# Altium project B293B MiRLIN Integrated PIC32.PrjPcb (part 1 of 2)
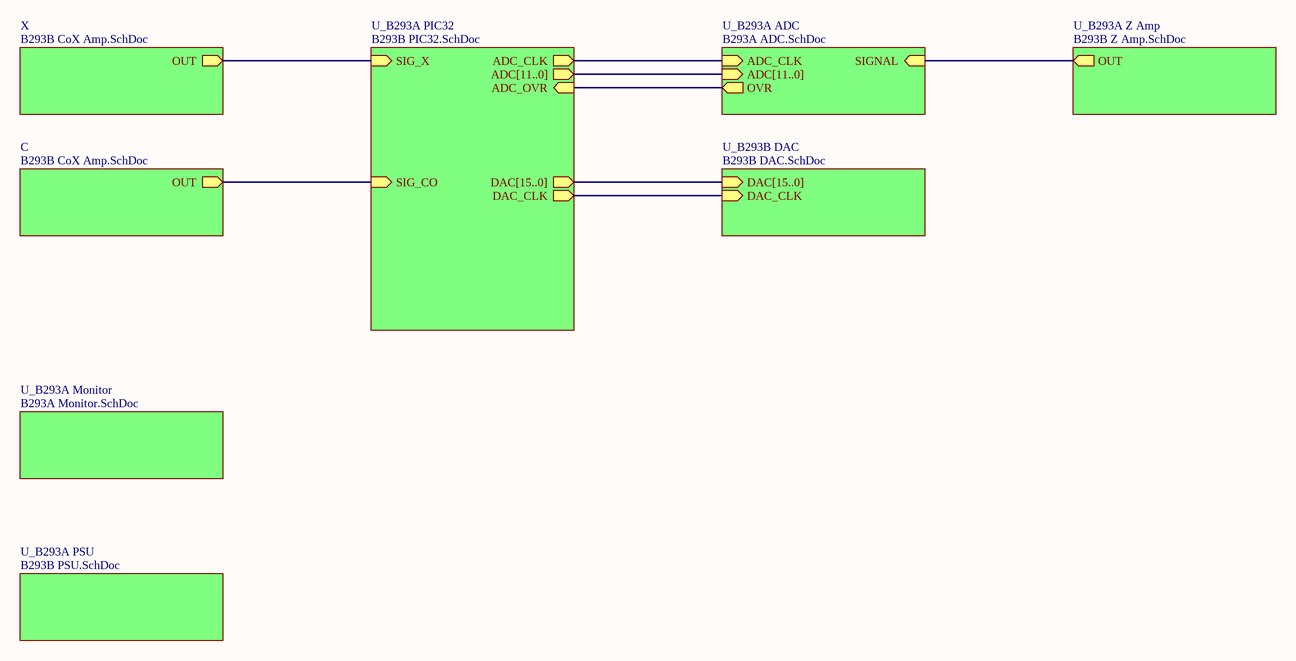
[diagram p0: B293B Top.SchDoc]
8 sheets, 227 parts. Net scope: hierarchical (ports join the sheet entries above them; power ports are global).
Board file: B293B MiRLIN Integrated PIC32.PcbDoc
Sheets:
  B293B Top.SchDoc
    U_B293A ADC = B293A ADC.SchDoc
    U_B293B DAC = B293B DAC.SchDoc
    U_B293A Monitor = B293A Monitor.SchDoc
    U_B293A PIC32 = B293B PIC32.SchDoc
    U_B293A PSU = B293B PSU.SchDoc
    U_B293A Z Amp = B293B Z Amp.SchDoc
    X = B293B CoX Amp.SchDoc
    C = B293B CoX Amp.SchDoc

## Sheet B293B Top.SchDoc
size A4

### Sub-sheets
C = B293B CoX Amp.SchDoc: OUT (out)
U_B293A ADC = B293A ADC.SchDoc: ADC_CLK (in), ADC[11..0] (in), OVR (out), SIGNAL (in)
U_B293A Monitor = B293A Monitor.SchDoc: no entries
U_B293A PIC32 = B293B PIC32.SchDoc: ADC_CLK (out), ADC[11..0] (out), ADC_OVR (in), DAC[15..0] (out), DAC_CLK (out), SIG_X (in), SIG_CO (in)
U_B293A PSU = B293B PSU.SchDoc: no entries
U_B293A Z Amp = B293B Z Amp.SchDoc: OUT (out)
U_B293B DAC = B293B DAC.SchDoc: DAC[15..0] (in), DAC_CLK (in)
X = B293B CoX Amp.SchDoc: OUT (out)

### Nets
ADC_CLK: sheet U_B293A ADC/ADC_CLK, sheet U_B293A PIC32/ADC_CLK
CLK: sheet U_B293B DAC/DAC_CLK, sheet U_B293A PIC32/DAC_CLK
OVR: sheet U_B293A ADC/OVR, sheet U_B293A PIC32/ADC_OVR
NetR2_2: sheet U_B293A ADC/SIGNAL, sheet U_B293A Z Amp/OUT
NetR16_C_2: sheet U_B293A PIC32/SIG_CO, sheet C/OUT
NetR16_X_2: sheet U_B293A PIC32/SIG_X, sheet X/OUT

### Buses and harness runs
bus sheet U_B293A ADC/ADC[11..0] = sheet U_B293A PIC32/ADC[11..0]
bus sheet U_B293A PIC32/DAC[15..0] = sheet U_B293B DAC/DAC[15..0]

## Sheet B293A ADC.SchDoc: ADC
size A4; DocumentNumber: 293; Revision: A
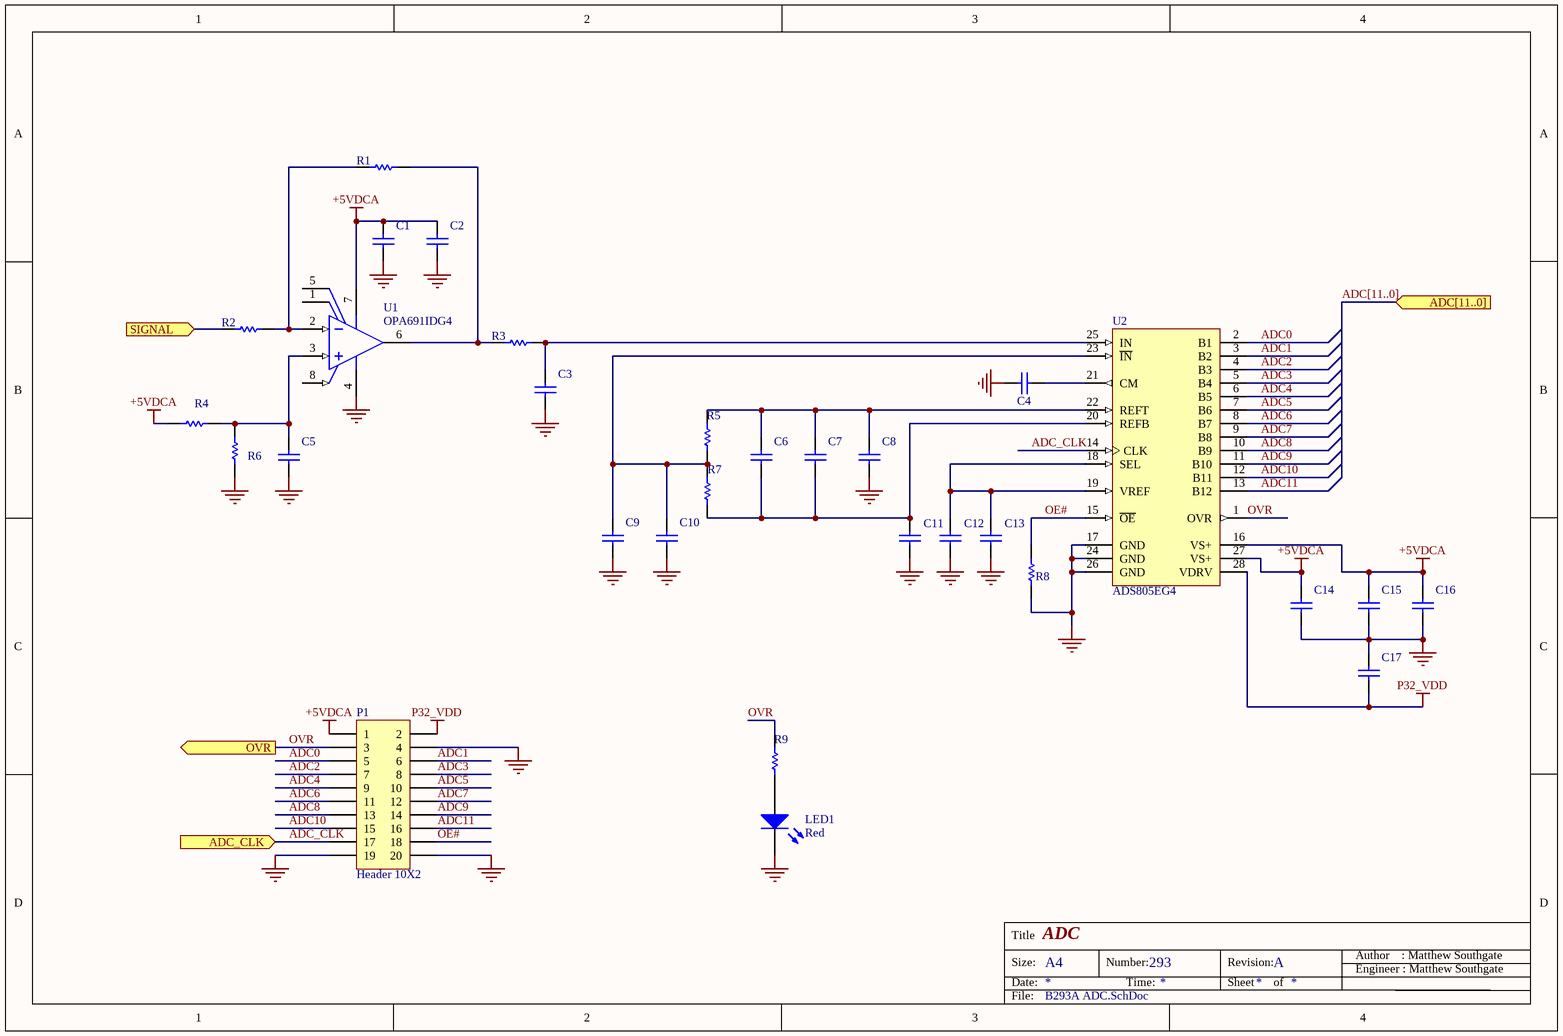
[diagram p1: B293A ADC.SchDoc]

### Parts
C1  CAP 100nF 50V 0805(2012)  [CAPC0805(2012)75_L]  (value not drawn)
C2  CAP 10uF 25V 0805(2012)  [CAPC0805(2012)145_N]  (value not drawn)
C3  CAP 1.5nF 50V 0805(2012)  [CAPC0805(2012)75_M]  (value not drawn)
C4  CAP 100nF 50V 0805(2012)  [CAPC0805(2012)75_L]  (value not drawn)
C5  CAP 100nF 50V 0805(2012)  [CAPC0805(2012)75_L]  (value not drawn)
C6  CAP 10uF 25V 0805(2012)  [CAPC0805(2012)145_N]  (value not drawn)
C7  CAP 100nF 50V 0805(2012)  [CAPC0805(2012)75_L]  (value not drawn)
C8  CAP 100nF 50V 0805(2012)  [CAPC0805(2012)75_L]  (value not drawn)
C9  CAP 10uF 25V 0805(2012)  [CAPC0805(2012)145_N]  (value not drawn)
C10  CAP 100nF 50V 0805(2012)  [CAPC0805(2012)75_L]  (value not drawn)
C11  CAP 100nF 50V 0805(2012)  [CAPC0805(2012)75_L]  (value not drawn)
C12  CAP 10uF 25V 0805(2012)  [CAPC0805(2012)145_N]  (value not drawn)
C13  CAP 100nF 50V 0805(2012)  [CAPC0805(2012)75_L]  (value not drawn)
C14  CAP 100nF 50V 0805(2012)  [CAPC0805(2012)75_L]  (value not drawn)
C15  CAP 100nF 50V 0805(2012)  [CAPC0805(2012)75_L]  (value not drawn)
C16  CAP 2.2uF 50V 0805(2012)  [CAPC0805(2012)145_M]  (value not drawn)
C17  CAP 100nF 50V 0805(2012)  [CAPC0805(2012)75_L]  (value not drawn)
LED1  Red  [1206 - LED]
P1  Header 10X2  [HDR2X10]
R1  1K8 5% 0805(2012)  [RESC0805(2012)_N]  (value not drawn)
R2  1K8 5% 0805(2012)  [RESC0805(2012)_N]  (value not drawn)
R3  47R 5% 0805(2012)  [RESC0805(2012)_M]  (value not drawn)
R4  1K8 5% 0805(2012)  [RESC0805(2012)_N]  (value not drawn)
R5  1K8 5% 0805(2012)  [RESC0805(2012)_N]  (value not drawn)
R6  680R 1% 0805(2012)  [RESC0805(2012)_L]  (value not drawn)
R7  1K8 5% 0805(2012)  [RESC0805(2012)_N]  (value not drawn)
R8  10K 1% 0805(2012)  [RESC0805(2012)_M]  (value not drawn)
R9  1K 5% 0805(2012)  [RESC0805(2012)_N]  (value not drawn)
U1  OPA691IDG4  [TI-D8_N]
U2  ADS805EG4  [TI-DB28_M]

### Ports
ADC[11..0] (in), ADC_CLK (in), OVR (out), SIGNAL (in)

### Nets
+5VDCA: C1.2 C2.2 C14.2 C15.2 C16.2 P1.1 R4.1 U1.7(VS+) U2.16(VS+) U2.27(VS+)  [project net V_+5VDCA]
GND: C1.1 C2.1 C3.1 C4.1 C5.1 C8.1 C9.1 C10.1 C11.1 C12.1 C13.1 C14.1 C15.1 C16.1 C17.2 LED1.K P1.4 P1.19 P1.20 R6.2 R8.2 U1.4(VS-) U2.17(GND) U2.24(GND) U2.26(GND)  [project net VSS]
P32_VDD: C17.1 P1.2 U2.28(VDRV)  [project net MON_VDD]
ADC0: P1.5 U2.2(B1)
ADC1: P1.6 U2.3(B2)
ADC2: P1.7 U2.4(B3)
ADC3: P1.8 U2.5(B4)
ADC4: P1.9 U2.6(B5)
ADC5: P1.10 U2.7(B6)
ADC6: P1.11 U2.8(B7)
ADC7: P1.12 U2.9(B8)
ADC8: P1.13 U2.10(B9)
ADC9: P1.14 U2.11(B10)
ADC10: P1.15 U2.12(B11)
ADC11: P1.16 U2.13(B12)
ADC_CLK: P1.17 U2.14(CLK) ; port ADC_CLK
OE#: P1.18 R8.1 U2.15(~{OE})
OVR: P1.3 R9.2 U2.1(OVR) ; port OVR
NetC3_2: C3.2 R3.1 U2.25(IN)
NetC4_2: C4.2 U2.21(CM)
NetC5_2: C5.2 R4.2 R6.1 U1.3(IN+)
NetC6_1: C6.1 C7.1 C11.2 R7.1 U2.20(REFB)
NetC6_2: C6.2 C7.2 C8.2 R5.2 U2.22(REFT)
NetC9_2: C9.2 C10.2 R5.1 R7.2 U2.23(~{IN})
NetC12_2: C12.2 C13.2 U2.18(SEL) U2.19(VREF)
NetLED1_A: LED1.A R9.1
NetR1_1: R1.1 R3.2 U1.6(OUT)
NetR1_2: R1.2 R2.1 U1.2(IN-)
NetR2_2: R2.2 ; port SIGNAL

Not connected (* = marked no-connect by the designer): U1 1(NC) 5(NC) 8(~{DIS})

### Buses and harness runs
bus ADC[11..0] = port ADC[11..0]

### Notes on the sheet
- Title
- Size:
- Date:
- A4
- Number:
- Time:
- Revision:
- Sheet
- of
- Engineer : Matthew Southgate
- Author    : Matthew Southgate
- File:

### Library data of the parts
C1 C4 C5 C7 C8 C10 C11 C13-C15 C17 = CMP-1036-04421-1: CAP 100nF 50V ±20% 0805 (2012 Metric) Thickness 0.75mm SMD; Case-Metric: 2012; Case-EIA: 0805; Value: 100nF; Max Thickness: 0.75 mm; Rated Voltage: 50 V; Tolerance: ±20%; Technology: SMT
C2 C6 C9 C12 = CMP-1036-04933-1: CAP 10uF 25V ±20% 0805 (2012 Metric) Thickness 1.45mm SMD; Case-EIA: 0805; Case-Metric: 2012; Technology: SMT; Tolerance: ±20%; Max Thickness: 1.45 mm; Value: 10uF; Rated Voltage: 25 V
C3 = CMP-1036-03122-1: CAP 1.5nF 50V ±10% 0805 (2012 Metric) Thickness 0.75mm SMD; Case-Metric: 2012; Case-EIA: 0805; Rated Voltage: 50 V; Technology: SMT; Value: 1.5nF; Max Thickness: 0.75 mm; Tolerance: ±10%
C16 = CMP-1036-04844-1: CAP 2.2uF 50V ±10% 0805 (2012 Metric) Thickness 1.45mm SMD; Case-Metric: 2012; Case-EIA: 0805; Tolerance: ±10%; Technology: SMT; Value: 2.2uF; Rated Voltage: 50 V; Max Thickness: 1.45 mm
LED1 = LED 1206 RED: LED, ALINGAP, SMD, 1206, RED; Manufacturer Part Number: KPC-3216SURCK; Manufacturer: KINGBRIGHT; Order Code: 1318261; Supplier: Farnell; Supplier 1: Farnell; RoHS: YES; Stock 1: 179; Pricing 1: 10=0.117, 50=0.097, 100=0.083, 250=0.074, 500=0.067, 800=0.0603, 800=0.0543, 7000=0.0488 (GBP); ComponentLink1URL: http://www.us.kingbright.com/images/catalog/SPEC/APC3216SURCK.pdf; ComponentLink1Description: http://www.us.kingbright.com/images/catalog/SPEC/APC3216SURCK.pdf; Supplier Part Number 1: 1318261
P1 = Header 10X2: Header, 10-Pin, Dual row; Fitted: No; LatestRevisionDate: 17-Jul-2002; LatestRevisionNote: Re-released for DXP Platform.; Publisher: Altium Limited
R1 R2 R4 R5 R7 = CMP-1013-00080-1: 1K8 0.125W 5% 0805 (2012 Metric)  SMD; Case-Metric: 2012; Value: 1800.00 Ohm; Case-EIA: 0805; Tolerance: 5 %; Technology: SMT; Power: 0.125 W
R3 = CMP-1013-00042-1: 47R 0.125W 5% 0805 (2012 Metric)  SMD; Value: 47.00 Ohm; Case-Metric: 2012; Case-EIA: 0805; Technology: SMT; Tolerance: 5 %; Power: 0.125 W
R6 = CMP-1013-00491-1: 680R 0.125W 1% 0805 (2012 Metric)  SMD; Case-EIA: 0805; Value: 680.00 Ohm; Case-Metric: 2012; Technology: SMT; Tolerance: 1 %; Power: 0.125 W
R8 = CMP-1013-00623-1: 10K 0.125W 1% 0805 (2012 Metric)  SMD; Case-Metric: 2012; Value: 10000.00 Ohm; Case-EIA: 0805; Power: 0.125 W; Technology: SMT; Tolerance: 1 %
R9 = CMP-1013-00074-1: 1K 0.125W 5% 0805 (2012 Metric)  SMD; Case-Metric: 2012; Case-EIA: 0805; Value: 1000.00 Ohm; Tolerance: 5 %; Technology: SMT; Power: 0.125 W
U1 = CMP-0018-00355-1: Wideband Current Feedback Operational Amplifier with Disable, 5 to 12 V, -40 to 85 degC, 8-pin SOIC (D8), Green (RoHS & no Sb/Br); Manufacturer: Texas Instruments; ComponentLink3Description: Package Specification; PackageVersion: 4040047-3/M, 06/2011; ComponentLink2Description: Datasheet; PackageReference: D8; DatasheetVersion: SBOS226D; ComponentLink1Description: Manufacturer URL; ComponentLink2URL: http://www.ti.com/general/docs/lit/getliterature.tsp?genericPartNumber=OPA691&fileType=pdf; ComponentLink3URL: http://www.ti.com/litv/pdf/msoi002j; PackageDescription: 8-Pin Plastic Small Outline, Body 4.9 x 3.9 mm, Pitch 1.27 mm; Code_JEDEC: MS-012; ComponentLink1URL: http://www.ti.com/
U2 = CMP-0003-00136-1: 12-Bit, 20 MSPS ADC Internal / External Reference, Flexible Input between 2 and 5 Vpp, Out of Range Indicator, -40 to 85 degC, 28-pin SOP (DB28), Green (RoHS & no Sb/Br); Manufacturer: Texas Instruments; PackageVersion: 4040065/E, 12/2001; ComponentLink2URL: http://www.ti.com/general/docs/lit/getliterature.tsp?genericPartNumber=ADS805&fileType=pdf; ComponentLink1URL: http://www.ti.com/; Code_JEDEC: MO-150; DatasheetVersion: SBAS073B; ComponentLink3URL: http://www.ti.com/lit/ml/msso002e/msso002e.pdf; ComponentLink1Description: Manufacturer URL; ComponentLink2Description: Datasheet; PackageDescription: 28-Pin Plastic Small Outline, Body 10.2 X 5.3 mm, Pitch 0.65 mm; PackageReference: DB28; ComponentLink3Description: Package Specification

## Sheet B293B DAC.SchDoc: DAC
size A4; DocumentNumber: 293; Revision: A
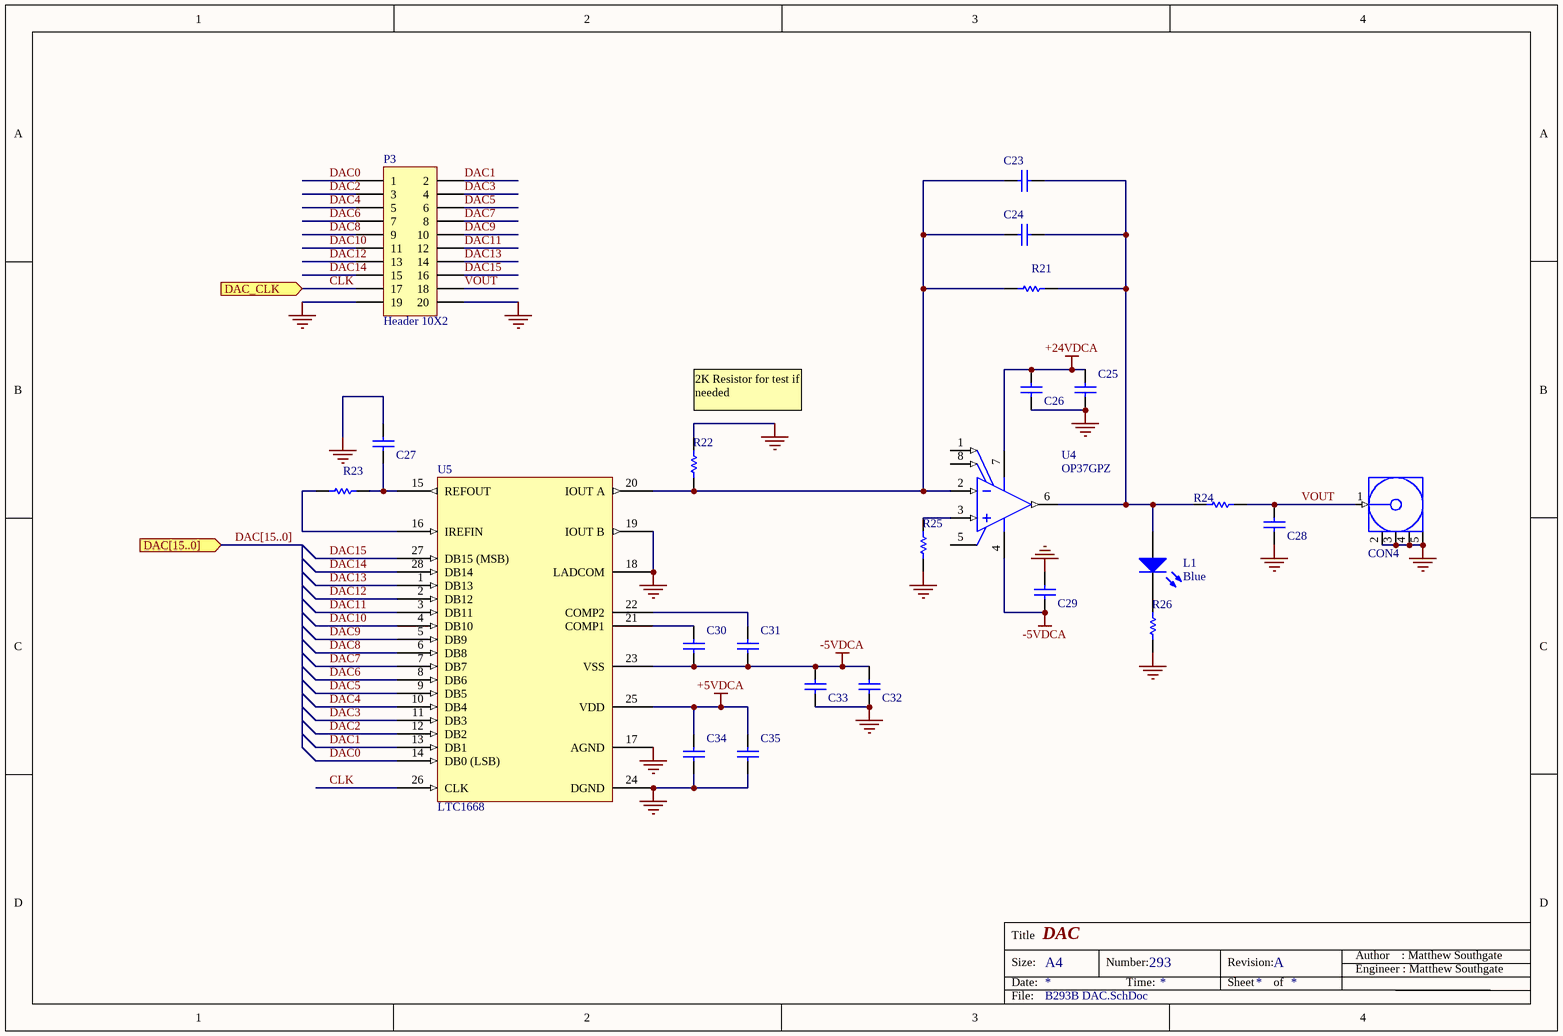
[diagram p2: B293B DAC.SchDoc]

### Parts
C23  CAP 4.7nF 50V 0805(2012)  [CAPC0805(2012)75_M]  (value not drawn)
C24  CAP 470pF 50V 0805(2012)  [CAPC0805(2012)100_M]  (value not drawn)
C25  CAP 10uF 25V 0805(2012)  [CAPC0805(2012)145_N]  (value not drawn)
C26  CAP 100nF 50V 0805(2012)  [CAPC0805(2012)100_M]  (value not drawn)
C27  CAP 100nF 50V 0805(2012)  [CAPC0805(2012)100_M]  (value not drawn)
C28  CAP 100nF 50V 0805(2012)  [CAPC0805(2012)100_M]  (value not drawn)
C29  CAP 100nF 50V 0805(2012)  [CAPC0805(2012)100_M]  (value not drawn)
C30  CAP 100nF 50V 0805(2012)  [CAPC0805(2012)100_M]  (value not drawn)
C31  CAP 100nF 50V 0805(2012)  [CAPC0805(2012)100_M]  (value not drawn)
C32  CAP 10uF 25V 0805(2012)  [CAPC0805(2012)145_N]  (value not drawn)
C33  CAP 100nF 50V 0805(2012)  [CAPC0805(2012)100_M]  (value not drawn)
C34  CAP 100nF 50V 0805(2012)  [CAPC0805(2012)100_M]  (value not drawn)
C35  CAP 10uF 25V 0805(2012)  [CAPC0805(2012)145_N]  (value not drawn)
CON4  SMA Vertical  [SMA Vertical]  (value not drawn)
L1  Blue  [1206 - LED]
P3  Header 10X2  [HDR2X10]
R21  2K2 5% 0805(2012)  [RESC0805(2012)_L]  (value not drawn)
R22  2K2 5% 0805(2012)  [RESC0805(2012)_L]  (value not drawn)
R23  2K2 5% 0805(2012)  [RESC0805(2012)_L]  (value not drawn)
R24  150R 5% 0805(2012)  [RESC0805(2012)_N]  (value not drawn)
R25  2K2 5% 0805(2012)  [RESC0805(2012)_L]  (value not drawn)
R26  6K8 5% 0805(2012)  [RESC0805(2012)_L]  (value not drawn)
U4  OP37GPZ  [ADI-N-8]
U5  LTC1668  [SOP65P800X200-28N]

### Ports
DAC[15..0] (in), DAC_CLK (in)

### Nets
+5VDCA: C34.2 C35.2 U5.25(VDD)  [project net V_+5VDCA]
+24VDCA: C25.2 C26.1 U4.7(V+)  [project net V_+24VDCA]
-5VDCA: C29.2 C30.1 C31.1 C32.1 C33.2 U4.4(V-) U5.23(VSS)  [project net V_-5VDCA]
GND: C25.1 C26.2 C27.1 C28.2 C29.1 C32.2 C33.1 C34.1 C35.1 CON4.2(GND) CON4.3(GND) CON4.4(GND) CON4.5(GND) P3.19 P3.20 R22.2 R25.1 R26.1 U5.17(AGND) U5.18(LADCOM) U5.19(IOUT_B) U5.24(DGND)  [project net VSS]
CLK: P3.17 U5.26(CLK) ; port DAC_CLK
DAC0: P3.1 U5.14(DB0_(LSB))
DAC1: P3.2 U5.13(DB1)
DAC2: P3.3 U5.12(DB2)
DAC3: P3.4 U5.11(DB3)
DAC4: P3.5 U5.10(DB4)
DAC5: P3.6 U5.9(DB5)
DAC6: P3.7 U5.8(DB6)
DAC7: P3.8 U5.7(DB7)
DAC8: P3.9 U5.6(DB8)
DAC9: P3.10 U5.5(DB9)
DAC10: P3.11 U5.4(DB10)
DAC11: P3.12 U5.3(DB11)
DAC12: P3.13 U5.2(DB12)
DAC13: P3.14 U5.1(DB13)
DAC14: P3.15 U5.28(DB14)
DAC15: P3.16 U5.27(DB15_(MSB))
VOUT: C28.1 CON4.1(Signal) P3.18 R24.1
NetC23_1: C23.1 C24.1 L1.A R21.2 R24.2 U4.6(OUT)
NetC23_2: C23.2 C24.2 R21.1 R22.1 U4.2(-IN) U5.20(IOUT_A)
NetC27_2: C27.2 R23.2 U5.15(REFOUT)
NetC30_2: C30.2 U5.21(COMP1)
NetC31_2: C31.2 U5.22(COMP2)
NetL1_K: L1.K R26.2
NetR23_1: R23.1 U5.16(IREFIN)
NetR25_2: R25.2 U4.3(+IN)

Not connected (* = marked no-connect by the designer): U4 1(VOS_TRIM) 5(NC) 8(VOS_TRIM)

### Buses and harness runs
bus DAC[15..0] = port DAC[15..0]

### Notes on the sheet
- (near R22) 2K Resistor for test if needed
- Title
- Size:
- Date:
- A4
- Number:
- Time:
- Revision:
- Sheet
- of
- Engineer : Matthew Southgate
- Author    : Matthew Southgate
- File:

### Library data of the parts
C23 = CMP-1036-03591-1: CAP 4.7nF 50V ±10% 0805 (2012 Metric) Thickness 0.75mm SMD; Case-Metric: 2012; Case-EIA: 0805; Fitted: No; Technology: SMT; Rated Voltage: 50 V; Value: 4.7nF; Tolerance: ±10%; Max Thickness: 0.75 mm
C24 = CMP-1036-02672-1: CAP 470pF 50V ±10% 0805 (2012 Metric) Thickness 1mm SMD; Case-Metric: 2012; Case-EIA: 0805; Fitted: No; Rated Voltage: 50 V; Max Thickness: 1 mm; Tolerance: ±10%; Technology: SMT; Value: 470pF
C25 C32 C35 = CMP-1036-04933-1: as C2 on sheet B293A ADC; Technology: SMT; Tolerance: ±20%; Max Thickness: 1.45 mm; Value: 10uF; Rated Voltage: 25 V
C26-C31 C33 C34 = CMP-1036-04423-1: CAP 100nF 50V ±20% 0805 (2012 Metric) Thickness 1mm SMD; Case-Metric: 2012; Case-EIA: 0805; Value: 100nF; Max Thickness: 1 mm; Rated Voltage: 50 V; Tolerance: ±20%; Technology: SMT
CON4 = SMA Vertical: Manufacturers Part No: 5-1814832-1; Order Code: 1248990; Supplier: Onecall
L1 = LED 1206 BLUE: LED, 1206, BLUE, 140MCD, 473NM; Manufacturer Part Number: 598-8291-107F; Manufacturer: DIALIGHT; Order Code: 2113953; Fitted: No; Supplier: Farnell; Supplier 1: Farnell; RoHS: YES; Stock 1: 239; Pricing 1: 10=0.176, 100=0.169, 250=0.163, 500=0.161, 1000=0.159, 3000=0.102, 3000=0.0999, 30000=0.0979 (GBP); ComponentLink1URL: http://www.farnell.com/datasheets/1484480.pdf; ComponentLink1Description: http://www.farnell.com/datasheets/1484480.pdf; Supplier Part Number 1: 2113953
P3 = Header 10X2: Header, 10-Pin, Dual row; LatestRevisionDate: 17-Jul-2002; LatestRevisionNote: Re-released for DXP Platform.; Publisher: Altium Limited
R21 R23 R25 = CMP-1013-00082-1: 2K2 0.125W 5% 0805 (2012 Metric)  SMD; Value: 2200.00 Ohm; Case-Metric: 2012; Case-EIA: 0805; Technology: SMT; Tolerance: 5 %; Power: 0.125 W
R22 = CMP-1013-00082-1: 2K2 0.125W 5% 0805 (2012 Metric)  SMD; Fitted: No; Value: 2200.00 Ohm; Case-Metric: 2012; Case-EIA: 0805; Technology: SMT; Tolerance: 5 %; Power: 0.125 W
R24 = CMP-1013-00054-1: 150R 0.125W 5% 0805 (2012 Metric)  SMD; Case-EIA: 0805; Case-Metric: 2012; Value: 150.00 Ohm; Tolerance: 5 %; Technology: SMT; Power: 0.125 W
R26 = CMP-1013-00094-1: 6K8 0.125W 5% 0805 (2012 Metric)  SMD; Value: 6800.00 Ohm; Case-EIA: 0805; Case-Metric: 2012; Technology: SMT; Tolerance: 5 %; Power: 0.125 W
U4 = CMP-0384-00210-1: Single Channel Low Noise Operational Amplifier, 63 MHz BW, 17 V/us SR, Industrial, 8-pin DIP (N-8), Tube; Manufacturer: Analog Devices; PackageReference: N-8; ComponentLink1Description: Manufacturer URL; ComponentLink1URL: http://www.analog.com/en/index.html; ComponentLink2URL: http://www.analog.com/static/imported-files/data_sheets/OP37.pdf; ComponentLink3Description: Package Specification; PackageDescription: 8-Pin Plastic Dual In-Line Package, Row spacing 7.62 mm, Pitch 2.54 mm; ComponentLink3URL: http:/www.analog.com/static/imported-files/packages/PKG_PDF/PDIP(N)/N_8.pdf; ComponentLink2Description: Datasheet; DatasheetVersion: Rev. B; PackageVersion: 070606-A; Code_JEDEC: MS-001
U5 = LTC1668: Manufacturer: LINEAR TECHNOLOGY; Manufacturer Part Number: LTC1668CG#PBF; Resolution (Bits): 16; Sampling Rate: 50; Input Channel Type: Parallel; Supply Voltage Range: ± 4.75V to ± 5.25; Digital IC Case Style: SSOP; No. of Pins: 28; A/D / D/A Features: D/A; Base Number: 1668; No. of DACs: 1; Output Type: Differential; SVHC: No SVHC (20-Jun-2013); Settling Time: 20; Supply Current: 33; Supply Voltage Max: 5.25; Supply Voltage Min: 4.75; Supplier 1: Farnell; Supplier Part Number 1: 1609779; RoHS: YES; Stock 1: 5; Pricing 1: 1=21.11, 10=15.83, 100=13.87, 250=13.42, 500=13.04 (GBP); Data Interface: Parallel; Operating Temperature Min: 0; Operating Temperature Max: 70; Packaging: Each; IC Case Style: SSOP; MSL: MSL 1 - Unlimited; No. of Bits: 16; Operating Temperature Range: 0°C to +70; Termination Type: SMD<!--FANDB--><div class="features-and-benefits-container"></div>; ComponentLink1URL: http://www.farnell.com/datasheets/1692371.pdf; ComponentLink1Description: http://www.farnell.com/datasheets/1692371.pdf; ComponentLink2URL: http://www.farnell.com/cad/1542850.zip; ComponentLink2Description: http://www.farnell.com/cad/1542850.zip; Supplier 2: Farnell; Supplier Part Number 2: 1609780; Stock 2: 68; Pricing 2: 1=23.01, 10=16.83, 100=15.73, 250=15.14, 500=14.63 (GBP); ComponentLink3URL: http://www.farnell.com/cad/1542852.zip; ComponentLink3Description: http://www.farnell.com/cad/1542852.zip; Supplier 3: Newark; Supplier Part Number 3: 56M3099; Stock 3: 53; Pricing 3: 1=25.76, 25=20.52, 100=15.9 (USD); ComponentLink4URL: http://www.linear.com/pc/downloadDocument.do?navId=H0,C1,C1155,C1005,C1151,P1850,D1839; ComponentLink4Description: http://www.linear.com/pc/downloadDocument.do?navId=H0,C1,C1155,C1005,C1151,P1850,D1839

## Sheet B293A Monitor.SchDoc: Monitor Circuits
size A4; DocumentNumber: 293; Revision: A
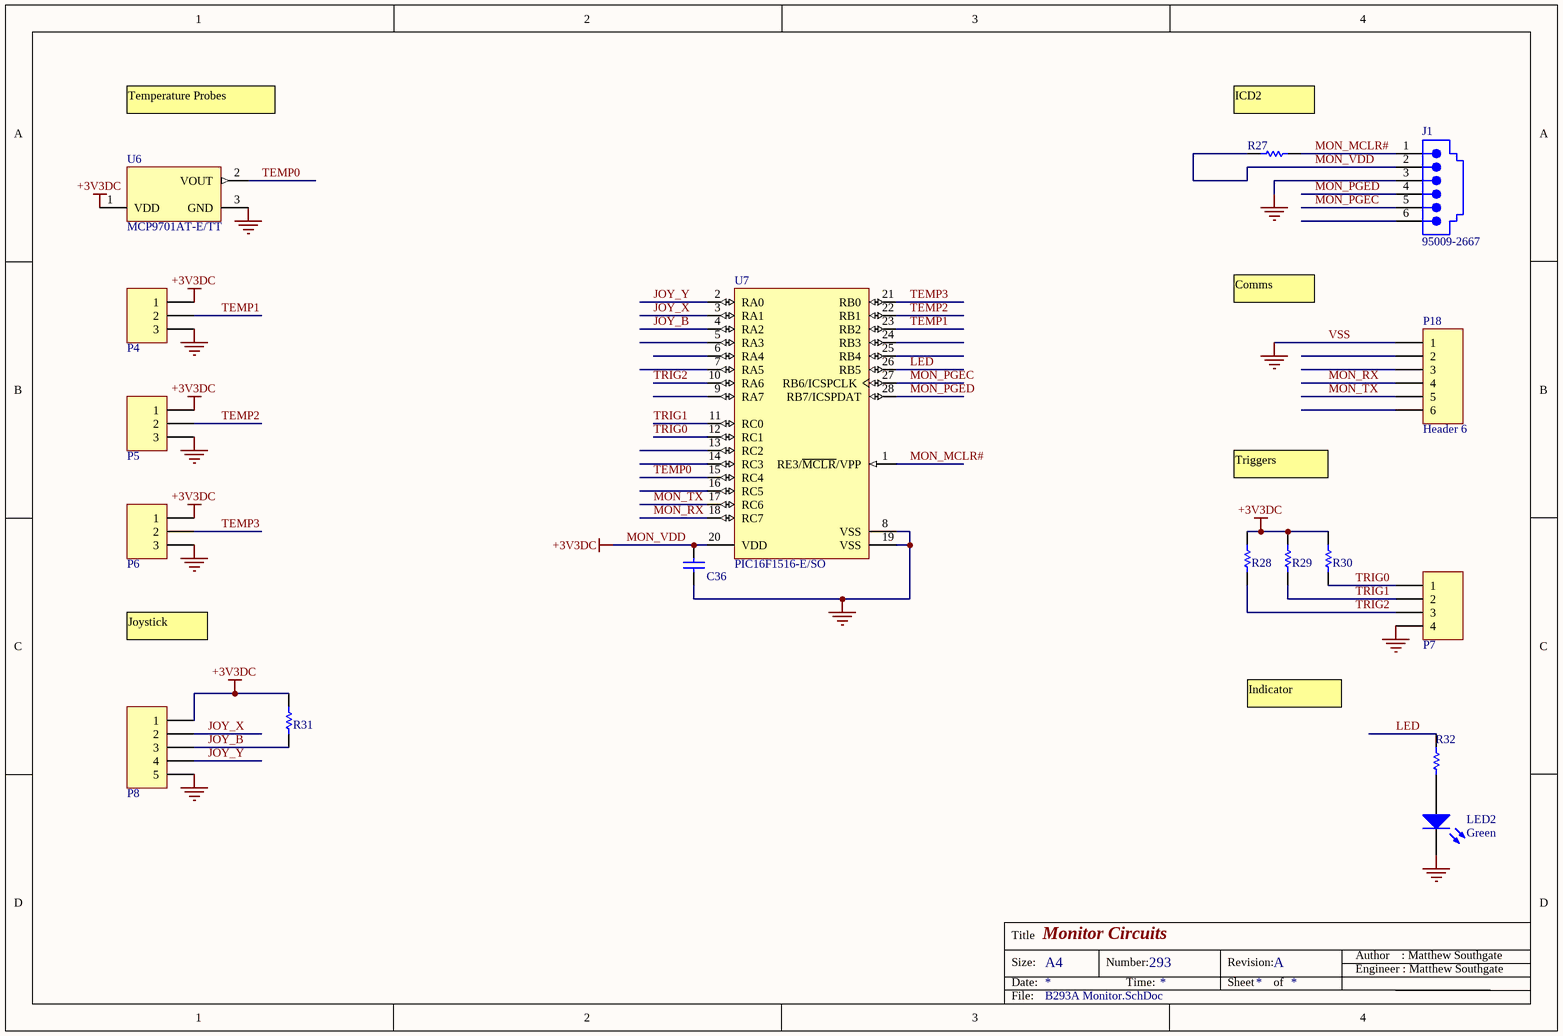
[diagram p3: B293A Monitor.SchDoc]

### Parts
C36  CAP 120nF 50V 0805(2012)  [CAPC0805(2012)145_N]  (value not drawn)
J1  95009-2667  [95009-2667]
LED2  Green  [1206 - LED]
P4  MOLEX SL 3W VERT  [MOLEX SL 3W Vertical with latch]  (value not drawn)
P5  MOLEX SL 3W VERT  [MOLEX SL 3W Vertical with latch]  (value not drawn)
P6  MOLEX SL 3W VERT  [MOLEX SL 3W Vertical with latch]  (value not drawn)
P7  MOLEX SL 4W VERT  [MOLEX SL 4W Vertical with latch]  (value not drawn)
P8  MOLEX SL 5W VERT  [MOLEX SL 5W Vertical with latch]  (value not drawn)
P18  Header 6  [HDR1X6]
R27  10K 5% 0805(2012)  [RESC0805(2012)_L]  (value not drawn)
R28  10K 5% 0805(2012)  [RESC0805(2012)_L]  (value not drawn)
R29  10K 5% 0805(2012)  [RESC0805(2012)_L]  (value not drawn)
R30  10K 5% 0805(2012)  [RESC0805(2012)_L]  (value not drawn)
R31  10K 5% 0805(2012)  [RESC0805(2012)_L]  (value not drawn)
R32  1K 5% 0805(2012)  [RESC0805(2012)_N]  (value not drawn)
U6  MCP9701AT-E/TT  [SOT-23-TT3_M]
U7  PIC16F1516-E/SO  [MCHP-SOIC-SO28_N]

### Nets
MON_VDD: C36.1 J1.2 P4.1 P5.1 P6.1 P8.1 R27.1 R28.2 R29.2 R30.2 R31.2 U6.1(VDD) U7.20(VDD)  [also labelled +3V3DC]
VSS: C36.2 J1.3 LED2.K P4.3 P5.3 P6.3 P7.4 P8.5 P18.1 U6.3(GND) U7.8(VSS) U7.19(VSS)  [also labelled GND]
JOY_B: P8.3 R31.1 U7.4(RA2)
JOY_X: P8.2 U7.3(RA1)
JOY_Y: P8.4 U7.2(RA0)
LED: R32.2 U7.26(RB5)
MON_MCLR#: J1.1 R27.2 U7.1(RE3/~{MCLR}/VPP)
MON_PGEC: J1.5 U7.27(RB6/ICSPCLK)
MON_PGED: J1.4 U7.28(RB7/ICSPDAT)
MON_RX: P18.4 U7.18(RC7)
MON_TX: P18.5 U7.17(RC6)
TEMP0: U6.2(VOUT) U7.15(RC4)
TEMP1: P4.2 U7.23(RB2)
TEMP2: P5.2 U7.22(RB1)
TEMP3: P6.2 U7.21(RB0)
TRIG0: P7.1 R30.1 U7.12(RC1)
TRIG1: P7.2 R29.1 U7.11(RC0)
TRIG2: P7.3 R28.1 U7.10(RA6)
NetLED2_A: LED2.A R32.1

Not connected (* = marked no-connect by the designer): J1 6; P18 2 3 6; U7 5(RA3) 6(RA4) 7(RA5) 9(RA7) 13(RC2) 14(RC3) 16(RC5) 24(RB3) 25(RB4)

### Notes on the sheet
- Temperature Probes
- (near R27) ICD2
- Comms
- Triggers
- Joystick
- Indicator
- Title
- Size:
- Date:
- A4
- Number:
- Time:
- Revision:
- Sheet
- of
- Engineer : Matthew Southgate
- Author    : Matthew Southgate
- File:

### Library data of the parts
C36 = CMP-1036-04456-1: CAP 120nF 50V ±20% 0805 (2012 Metric) Thickness 1.45mm SMD; Case-Metric: 2012; Case-EIA: 0805; Value: 120nF; Max Thickness: 1.45 mm; Rated Voltage: 50 V; Tolerance: ±20%; Technology: SMT
J1 = 95009-2667: Right Angle, Standard Profile, Flush Mount PCB Jack; Manufacturer: MOLEX; Ports: 1; Positions/Loaded: Port1 - 6/6; PerformanceCategory: 3; PCB_Mounting: Thru-Hole; DrillSize: Nominal, Rounded to nearest 0.05mm; PCB_Layout: Complies with Manufacturer's Recommendation.; Published: 25-Jun-2002; DatasheetDocument: 18-Dec-2001; PackageDocument: 18-Dec-2001; PackageReference: 95009-2667; Publisher: Altium Limited; ComponentLink1Description: Manufacturer Link; ComponentLink1URL: http://www.molex.com/; Supplier 1: Farnell; Supplier Part Number 1: 1393306; Manufacturer Part Number: 95009-2667; RoHS: YES; Stock 1: 159; Pricing 1: 5=0.85, 100=0.52, 250=0.42, 500=0.41, 1000=0.38, 2500=0.34, 2500=0.306, 20000=0.275 (GBP); ComponentLink2URL: http://www.farnell.com/cad/1597831.pdf; ComponentLink2Description: http://www.farnell.com/cad/1597831.pdf; ComponentLink3URL: http://www.farnell.com/datasheets/1627656.pdf; ComponentLink3Description: http://www.farnell.com/datasheets/1627656.pdf; Supplier 2: Newark; Supplier Part Number 2: 60H6049; Stock 2: 0; ComponentLink4URL: http://www.farnell.com/datasheets/1025072.pdf; ComponentLink4Description: http://www.farnell.com/datasheets/1025072.pdf; ComponentLink5URL: http://www.molex.com/pdm_docs/sd/950092667_sd.pdf; ComponentLink5Description: http://www.molex.com/pdm_docs/sd/950092667_sd.pdf
LED2 = LED 1206 GREEN: LED, SMD, 1206, CLR LENS, GREEN; Manufacturer Part Number: KPC-3216SGC; Manufacturer: KINGBRIGHT; Order Code: 1318254; Supplier: Farnell; Supplier 1: Farnell; RoHS: YES; Stock 1: 798; Pricing 1: 10=0.2, 50=0.169, 100=0.146, 250=0.126, 500=0.119, 1000=0.107, 1000=0.0964, 8000=0.0868 (GBP); ComponentLink1URL: http://www.us.kingbright.com/images/catalog/SPEC/APC3216SGC.pdf; ComponentLink1Description: http://www.us.kingbright.com/images/catalog/SPEC/APC3216SGC.pdf; Supplier Part Number 1: 1318254
P4-P6 = MOLEX SL 3W VERT: MOLEX - 70543-0037 - WIRE-BOARD CONNECTOR HEADER 3POS, 2.54MM; Order Code: 1366811; Supplier: Farnell; Manufacturer Part Number: 70543-0037
P7 = MOLEX SL 4W VERT: MOLEX - 70543-0108 - CONNECTOR, HEADER, 4POS, 1ROW, 2.54MM; Order Code: 1508499; Supplier: Farnell; Manufacturer Part Number: 70543-0108
P8 = MOLEX SL 5W VERT: MOLEX - 70543-0004 - CONNECTOR, HEADER, 5POS, 1ROW, 2.54MM; Order Code: 2060692; Supplier: Farnell; Manufacturer Part Number: 70543-0004
P18 = Header 6: Header, 6-Pin; LatestRevisionDate: 17-Jul-2002; LatestRevisionNote: Re-released for DXP Platform.; Publisher: Altium Limited
R27-R31 = CMP-1013-00098-1: 10K 0.125W 5% 0805 (2012 Metric)  SMD; Case-Metric: 2012; Value: 10000.00 Ohm; Case-EIA: 0805; Power: 0.125 W; Technology: SMT; Tolerance: 5 %
R32 = CMP-1013-00074-1: as R9 on sheet B293A ADC; Tolerance: 5 %; Technology: SMT; Power: 0.125 W
U6 = CMP-0192-00221-1: Low-Power Linear Active Thermistor IC, 3-Pin SOT-23, Extended Temperature, Tape and Reel; PackageDescription: 3-Lead Plastic Small Outline Transistor (TT) [SOT-23]; DatasheetVersion: revE, Apr-2009; Code_IPC: SOT23-3; PackageVersion: revBB, Aug-2009; PackageReference: SOT-23-TT3
U7 = CMP-0115-02502-1: Flash Microcontroller with XLP Technology, 20 MHz, 24 I/O, -40 to 125 degC, 28-pin SOIC (SO28), Tube; Manufacturer: Microchip; Digital Communication: 1 -A/E/USART, 1 -MSSP(SPI/I2C); I/O Pins: 24; # of A/D Channels: 17; Program Memory KWords: 8; RAM: 512; Max. CPU Speed MHz: 20; Program Memory KBytes: 14; Operation Voltage Range: 2.3V - 5.5V; Timers: 2 - 8-bit, 1 - 16-bit; Internal Oscillator: 16 MHz, 32 kHz; Packing: TUBE; ComponentLink2URL: http://www.microchip.com/stellent/groups/techpub_sg/documents/packagingspec/en012702.pdf; ComponentLink2Description: Package Specification; PackageDescription: 28-Lead Plastic Small Outline, 17.9 x 7.5 mm Body, 1.27 mm Pitch; ComponentLink1Description: Datasheet; Mounting Technology: Surface Mount; RoHS: TRUE; ComponentLink1URL: http://ww1.microchip.com/downloads/en/DeviceDoc/41452C.pdf; PackageVersion: C04-052C, 12/2012; Memory Type: Flash; DatasheetVersion: Rev. C; PartNumber: PIC16F1516-E/SO; ComponentLink3URL: Product URL:http://www.microchip.com/datasheet/PIC16F1516; PackageReference: SOIC-SO28; ComponentLink3Description: URL Link1

## Sheet B293B PIC32.SchDoc: PIC32 Subsheet
size A3; ApprovedBy: Matt Southgate; CheckedBy: Matt Southgate; Author: Matt Southgate; CompanyName: Matt Southgate; DrawnBy: Matt Southgate; Engineer: Matt Southgate; DocumentNumber: 293; Revision: A; SheetNumber: 1; PageSetup: Record=PageOptions|CenterHorizontal=True|CenterVertical=True|PrintScale=1.39|XCorrection=1.00|YCorrection=1.00|PrintKind=1|BorderSize=5000000|LeftOffset=0|BottomOffset=0|Orientation=2|PaperLength=1000|PaperWidth=1000|Scale=100|PaperSource=15|PrintQuality=600|MediaType=1|DitherType=10|PaperKind=A3|PrintScaleMode=1
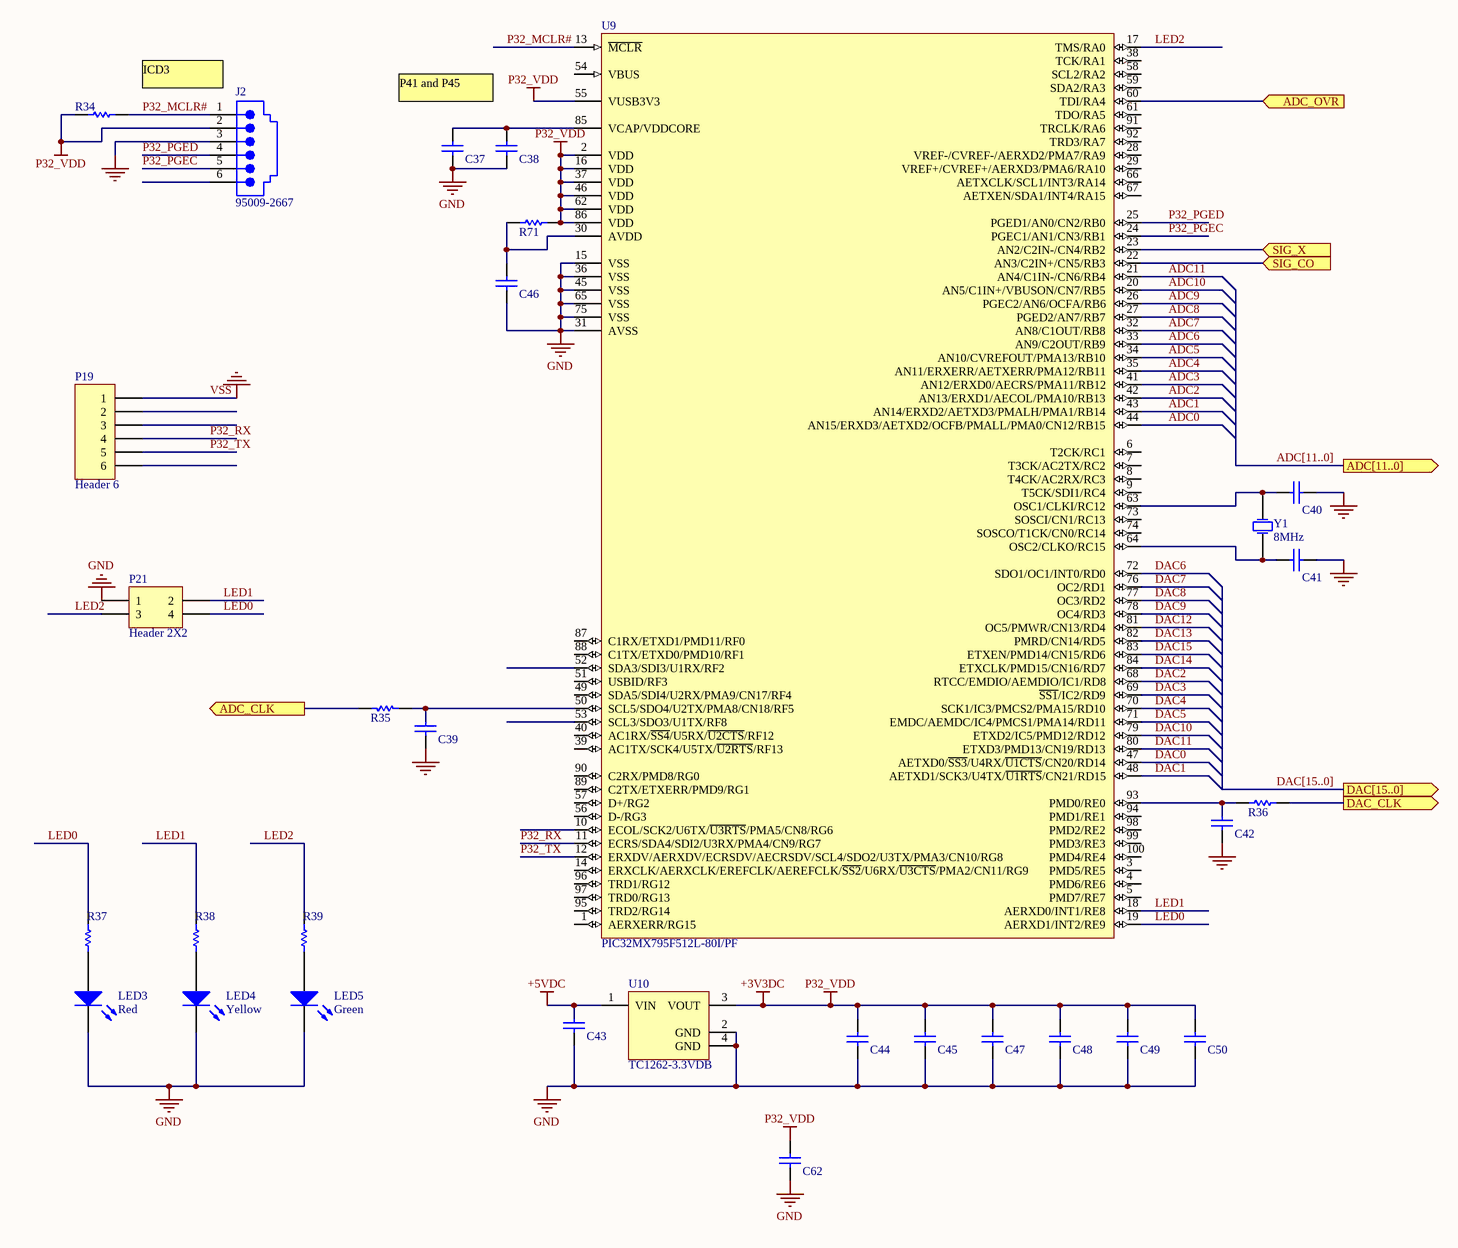
[diagram p4: B293B PIC32.SchDoc]

### Parts
C37  CAP 10uF 25V 0805(2012)  [CAPC0805(2012)145_N]  (value not drawn)
C38  CAP 100nF 50V 1206(3216)  [CAPC1206(3216)170_L]  (value not drawn)
C39  CAP 1uF 25V 0805(2012)  [CAPC0805(2012)100_N]  (value not drawn)
C40  CAP 15pF 50V 0805(2012)  [CAPC0805(2012)75_L]  (value not drawn)
C41  CAP 15pF 50V 0805(2012)  [CAPC0805(2012)75_L]  (value not drawn)
C42  CAP 1uF 25V 0805(2012)  [CAPC0805(2012)100_N]  (value not drawn)
C43  CAP 10uF 25V 0805(2012)  [CAPC0805(2012)145_N]  (value not drawn)
C44  CAP 100nF 50V 0603(1608)  [CAPC0603(1608)100_N]  (value not drawn)
C45  CAP 100nF 50V 0603(1608)  [CAPC0603(1608)100_N]  (value not drawn)
C46  CAP 100nF 50V 0603(1608)  [CAPC0603(1608)100_N]  (value not drawn)
C47  CAP 100nF 50V 0603(1608)  [CAPC0603(1608)100_N]  (value not drawn)
C48  CAP 100nF 50V 0603(1608)  [CAPC0603(1608)100_N]  (value not drawn)
C49  CAP 100nF 50V 0603(1608)  [CAPC0603(1608)100_N]  (value not drawn)
C50  CAP 100nF 50V 0603(1608)  [CAPC0603(1608)100_N]  (value not drawn)
C62  CAP 47uF 25V 2220(5750)  [CAPC2220(5750)230_N]  (value not drawn)
J2  95009-2667  [95009-2667]
LED3  Red  [1206 - LED]
LED4  Yellow  [1206 - LED]
LED5  Green  [1206 - LED]
P19  Header 6  [HDR1X6]
P21  Header 2X2  [HDR2X2]
R34  10K 5% 0805(2012)  [RESC0805(2012)_L]  (value not drawn)
R35  10R 5% 0805(2012)  [RESC0805(2012)_L]  (value not drawn)
R36  220R 5% 0805(2012)  [RESC0805(2012)_L]  (value not drawn)
R37  1K 5% 0805(2012)  [RESC0805(2012)_N]  (value not drawn)
R38  1K 5% 0805(2012)  [RESC0805(2012)_N]  (value not drawn)
R39  1K 5% 0805(2012)  [RESC0805(2012)_N]  (value not drawn)
R71  10R 1% 0805(2012)  [RESC0805(2012)_M]  (value not drawn)
U9  PIC32MX795F512L-80I/PF  [TQFP-PF100_L]
U10  TC1262-3.3VDB  [SOT-223-DB3_L]
Y1  8MHz  [CRYSTAL_HC49-US-SM]

### Ports
ADC[11..0] (out), ADC_CLK (out), ADC_OVR (in), DAC[15..0] (out), DAC_CLK (out), SIG_CO (in), SIG_X (in)

### Nets
+3V3DC: C44.1 C45.1 C47.1 C48.1 C49.1 C50.1 C62.2 J2.2 R34.1 R71.2 U9.2(VDD) U9.16(VDD) U9.37(VDD) U9.46(VDD) U9.55(VUSB3V3) U9.62(VDD) U9.86(VDD) U10.3(VOUT)  [also labelled P32_VDD]  [project net MON_VDD]
+5VDC: C43.1 U10.1(VIN)  [project net V_+5VDC]
VSS: C37.2 C38.2 C39.2 C40.1 C41.1 C42.2 C43.2 C44.2 C45.2 C46.2 C47.2 C48.2 C49.2 C50.2 C62.1 J2.3 LED3.K LED4.K LED5.K P19.1 P21.1 U9.15(VSS) U9.31(AVSS) U9.36(VSS) U9.45(VSS) U9.65(VSS) U9.75(VSS) U10.2(GND) U10.4(GND)  [also labelled GND]
ADC0: U9.44(AN15/ERXD3/AETXD2/OCFB/PMALL/PMA0/CN12/RB15)
ADC1: U9.43(AN14/ERXD2/AETXD3/PMALH/PMA1/RB14)
ADC2: U9.42(AN13/ERXD1/AECOL/PMA10/RB13)
ADC3: U9.41(AN12/ERXD0/AECRS/PMA11/RB12)
ADC4: U9.35(AN11/ERXERR/AETXERR/PMA12/RB11)
ADC5: U9.34(AN10/CVREFOUT/PMA13/RB10)
ADC6: U9.33(AN9/C2OUT/RB9)
ADC7: U9.32(AN8/C1OUT/RB8)
ADC8: U9.27(PGED2/AN7/RB7)
ADC9: U9.26(PGEC2/AN6/OCFA/RB6)
ADC10: U9.20(AN5/C1IN+/VBUSON/CN7/RB5)
ADC11: U9.21(AN4/C1IN-/CN6/RB4)
ADC_CLK: R35.2 ; port ADC_CLK
CLK: R36.2 ; port DAC_CLK
DAC0: U9.47(AETXD0/~{SS3}/U4RX/~{U1CTS}/CN20/RD14)
DAC1: U9.48(AETXD1/SCK3/U4TX/~{U1RTS}/CN21/RD15)
DAC2: U9.68(RTCC/EMDIO/AEMDIO/IC1/RD8)
DAC3: U9.69(~{SS1}/IC2/RD9)
DAC4: U9.70(SCK1/IC3/PMCS2/PMA15/RD10)
DAC5: U9.71(EMDC/AEMDC/IC4/PMCS1/PMA14/RD11)
DAC6: U9.72(SDO1/OC1/INT0/RD0)
DAC7: U9.76(OC2/RD1)
DAC8: U9.77(OC3/RD2)
DAC9: U9.78(OC4/RD3)
DAC10: U9.79(ETXD2/IC5/PMD12/RD12)
DAC11: U9.80(ETXD3/PMD13/CN19/RD13)
DAC12: U9.81(OC5/PMWR/CN13/RD4)
DAC13: U9.82(PMRD/CN14/RD5)
DAC14: U9.84(ETXCLK/PMD15/CN16/RD7)
DAC15: U9.83(ETXEN/PMD14/CN15/RD6)
LED0: P21.4 R37.2 U9.19(AERXD1/INT2/RE9)
LED1: P21.2 R38.2 U9.18(AERXD0/INT1/RE8)
LED2: P21.3 R39.2 U9.17(TMS/RA0)
OVR: U9.60(TDI/RA4) ; port ADC_OVR
P32_MCLR#: J2.1 R34.2 U9.13(~{MCLR})
P32_PGEC: J2.5 U9.24(PGEC1/AN1/CN3/RB1)
P32_PGED: J2.4 U9.25(PGED1/AN0/CN2/RB0)
P32_RX: P19.4 U9.11(ECRS/SDA4/SDI2/U3RX/PMA4/CN9/RG7)
P32_TX: P19.5 U9.12(ERXDV/AERXDV/ECRSDV/AECRSDV/SCL4/SDO2/U3TX/PMA3/CN10/RG8)
NetC37_1: C37.1 C38.1 U9.85(VCAP/VDDCORE)
NetC39_1: C39.1 R35.1 U9.50(SCL5/SDO4/U2TX/PMA8/CN18/RF5)
NetC40_2: C40.2 U9.63(OSC1/CLKI/RC12) Y1.1(OSC1)
NetC41_2: C41.2 U9.64(OSC2/CLKO/RC15) Y1.2(OSC2)
NetC42_1: C42.1 R36.1 U9.93(PMD0/RE0)
NetC46_1: C46.1 R71.1 U9.30(AVDD)
NetLED3_A: LED3.A R37.1
NetLED4_A: LED4.A R38.1
NetLED5_A: LED5.A R39.1
NetR16_C_2: U9.22(AN3/C2IN+/CN5/RB3) ; port SIG_CO
NetR16_X_2: U9.23(AN2/C2IN-/CN4/RB2) ; port SIG_X

Not connected (* = marked no-connect by the designer): J2 6; P19 2 3 6; U9 1(AERXERR/RG15) 3(PMD5/RE5) 4(PMD6/RE6) 5(PMD7/RE7) 6(T2CK/RC1) 7(T3CK/AC2TX/RC2) 8(T4CK/AC2RX/RC3) 9(T5CK/SDI1/RC4) 10(ECOL/SCK2/U6TX/~{U3RTS}/PMA5/CN8/RG6) 14(ERXCLK/AERXCLK/EREFCLK/AEREFCLK/~{SS2}/U6RX/~{U3CTS}/PMA2/CN11/RG9) 28(VREF-/CVREF-/AERXD2/PMA7/RA9) 29(VREF+/CVREF+/AERXD3/PMA6/RA10) 38(TCK/RA1) 39(AC1TX/SCK4/U5TX/~{U2RTS}/RF13) 40(AC1RX/~{SS4}/U5RX/~{U2CTS}/RF12) 49(SDA5/SDI4/U2RX/PMA9/CN17/RF4) 51(USBID/RF3) 52(SDA3/SDI3/U1RX/RF2) 53(SCL3/SDO3/U1TX/RF8) 54(VBUS) 56(D-/RG3) 57(D+/RG2) 58(SCL2/RA2) 59(SDA2/RA3) 61(TDO/RA5) 66(AETXCLK/SCL1/INT3/RA14) 67(AETXEN/SDA1/INT4/RA15) 73(SOSCI/CN1/RC13) 74(SOSCO/T1CK/CN0/RC14) 87(C1RX/ETXD1/PMD11/RF0) 88(C1TX/ETXD0/PMD10/RF1) 89(C2TX/ETXERR/PMD9/RG1) 90(C2RX/PMD8/RG0) 91(TRCLK/RA6) 92(TRD3/RA7) 94(PMD1/RE1) 95(TRD2/RG14) 96(TRD1/RG12) 97(TRD0/RG13) 98(PMD2/RE2) 99(PMD3/RE3) 100(PMD4/RE4)

### Buses and harness runs
bus ADC[11..0] = port ADC[11..0]
bus DAC[15..0] = port DAC[15..0]

### Notes on the sheet
- ICD3
- P41 and P45
- Title
- Size:
- Date:
- A3
- Number:
- Time:
- Revision:
- Sheet
- of
- Engineer : Matthew Southgate
- Author    : Matthew Southgate
- File:

### Library data of the parts
C37 C43 = CMP-1036-04933-1: as C2 on sheet B293A ADC; Technology: SMT; Tolerance: ±20%; Max Thickness: 1.45 mm; Value: 10uF; Rated Voltage: 25 V
C38 = CMP-1037-04201-1: CAP 100nF 50V ±10% 1206 (3216 Metric) Thickness 1.7mm SMD; Case-Metric: 3216; Case-EIA: 1206; Value: 100nF; Max Thickness: 1.7 mm; Rated Voltage: 50 V; Tolerance: ±10%; Technology: SMT
C39 C42 = CMP-1036-04756-1: CAP 1uF 25V ±20% 0805 (2012 Metric) Thickness 1mm SMD; Case-Metric: 2012; Case-EIA: 0805; Max Thickness: 1 mm; Tolerance: ±20%; Technology: SMT; Value: 1uF; Rated Voltage: 25 V
C40 C41 = CMP-1036-01043-1: CAP 15pF 50V ±10% 0805 (2012 Metric) Thickness 0.75mm SMD; Case-EIA: 0805; Case-Metric: 2012; Max Thickness: 0.75 mm; Rated Voltage: 50 V; Technology: SMT; Value: 15pF; Tolerance: ±10%
C44-C50 = CMP-1035-02592-1: CAP 100nF 50V ±10% 0603 (1608 Metric) Thickness 1mm SMD; Case-Metric: 1608; Case-EIA: 0603; Value: 100nF; Max Thickness: 1 mm; Rated Voltage: 50 V; Tolerance: ±10%; Technology: SMT
C62 = CMP-1042-00785-1: CAP 47uF 25V -20% to +80% 2220 (5750 Metric) Thickness 2.2mm SMD; Case-Metric: 5750; Case-EIA: 2220; Rated Voltage: 25 V; Tolerance: -20% to +80%; Technology: SMT; Value: 47uF; Max Thickness: 2.2 mm
J2 = 95009-2667: Right Angle, Standard Profile, Flush Mount PCB Jack; Ports: 1; Positions/Loaded: Port1 - 6/6; PerformanceCategory: 3; PCB_Mounting: Thru-Hole; DrillSize: Nominal, Rounded to nearest 0.05mm; PCB_Layout: Complies with Manufacturer's Recommendation.; Published: 25-Jun-2002; DatasheetDocument: 18-Dec-2001; PackageDocument: 18-Dec-2001; PackageReference: 95009-2667; Publisher: Altium Limited; ComponentLink1Description: Manufacturer Link; ComponentLink1URL: http://www.molex.com/
LED3 = LED 1206 RED: LED, ALINGAP, SMD, 1206, RED; Manufacturer Part Number: KPC-3216SURCK; Order Code: 1318261; Supplier: Farnell
LED4 = LED 1206 YELLOW: LED, ALINGAP, SMD, 1206, YELLOW; Manufacturer Part Number: KPC-3216SYCK; Order Code: 1318262; Supplier: Farnell
LED5 = LED 1206 GREEN: LED, SMD, 1206, CLR LENS, GREEN; Manufacturer Part Number: KPC-3216SGC; Order Code: 1318254; Supplier: Farnell
P19 = Header 6: Header, 6-Pin; LatestRevisionDate: 17-Jul-2002; LatestRevisionNote: Re-released for DXP Platform.; Publisher: Altium Limited
P21 = Header 2X2: Header, 2-Pin, Dual row; LatestRevisionDate: 17-Jul-2002; LatestRevisionNote: Re-released for DXP Platform.; Publisher: Altium Limited
R34 = CMP-1013-00098-1: as R27 on sheet B293A Monitor; Power: 0.125 W; Technology: SMT; Tolerance: 5 %
R35 = CMP-1013-00026-1: 10R 0.125W 5% 0805 (2012 Metric)  SMD; Value: 10.00 Ohm; Case-Metric: 2012; Case-EIA: 0805; Technology: SMT; Tolerance: 5 %; Power: 0.125 W
R36 = CMP-1013-00058-1: 220R 0.125W 5% 0805 (2012 Metric)  SMD; Value: 220.00 Ohm; Case-EIA: 0805; Case-Metric: 2012; Tolerance: 5 %; Technology: SMT; Power: 0.125 W
R37-R39 = CMP-1013-00074-1: as R9 on sheet B293A ADC; Tolerance: 5 %; Technology: SMT; Power: 0.125 W
R71 = CMP-1013-00284-1: 10R 0.125W 1% 0805 (2012 Metric)  SMD; Case-Metric: 2012; Value: 10.00 Ohm; Case-EIA: 0805; Tolerance: 1 %; Technology: SMT; Power: 0.125 W
U9 = CMP-0048-00315-1: High Performance 80 MHz MIPS-Based 32-Bit Flash Microcontroller with USB, CAN and Ethernet, 512KB Program Memory, 100-pin TQFP, Industrial Temperature; ComponentLink2Description: Packaging Specification; ComponentLink3URL: http://www.microchip.com/; ComponentLink2URL: http://ww1.microchip.com/downloads/en/PackagingSpec/en012702.pdf; DatasheetVersion: revG, May-2011; ComponentLink1Description: Datasheet; PackageVersion: revBB, Aug-2009; ComponentLink3Description: Microchip.com Home; ComponentLink1URL: http://ww1.microchip.com/downloads/en/DeviceDoc/61156G.pdf; PackageDescription: 100-Lead Thin Plastic Quad Flat Pack (PF) - 14x14x1mm Body, 2.00mm [TQFP]; PackageReference: TQFP-PF100
U10 = CMP-0136-00483-1: 500mA Fixed Output CMOS LDO, 3-Pin SOT-223, Extended Temperature; PackageVersion: revBB, Aug-2009; DatasheetVersion: revB, 2002; PackageDescription: 3-Lead Plastic Small Outline Transistor (DB) [SOT-223]; PackageReference: SOT-223-DB3
Y1 = SMD Crystal 8HMz HC-49: CRYSTAL, 8MHZ, 16PF, SMD; Manufacturer Part Number: HC49SM-8-30-50-60-16-ATF; Supplier: Onecall; Supplier Part Number: 1667012